# EAGLE design PIZ-II (EAGLE 7.6.0)
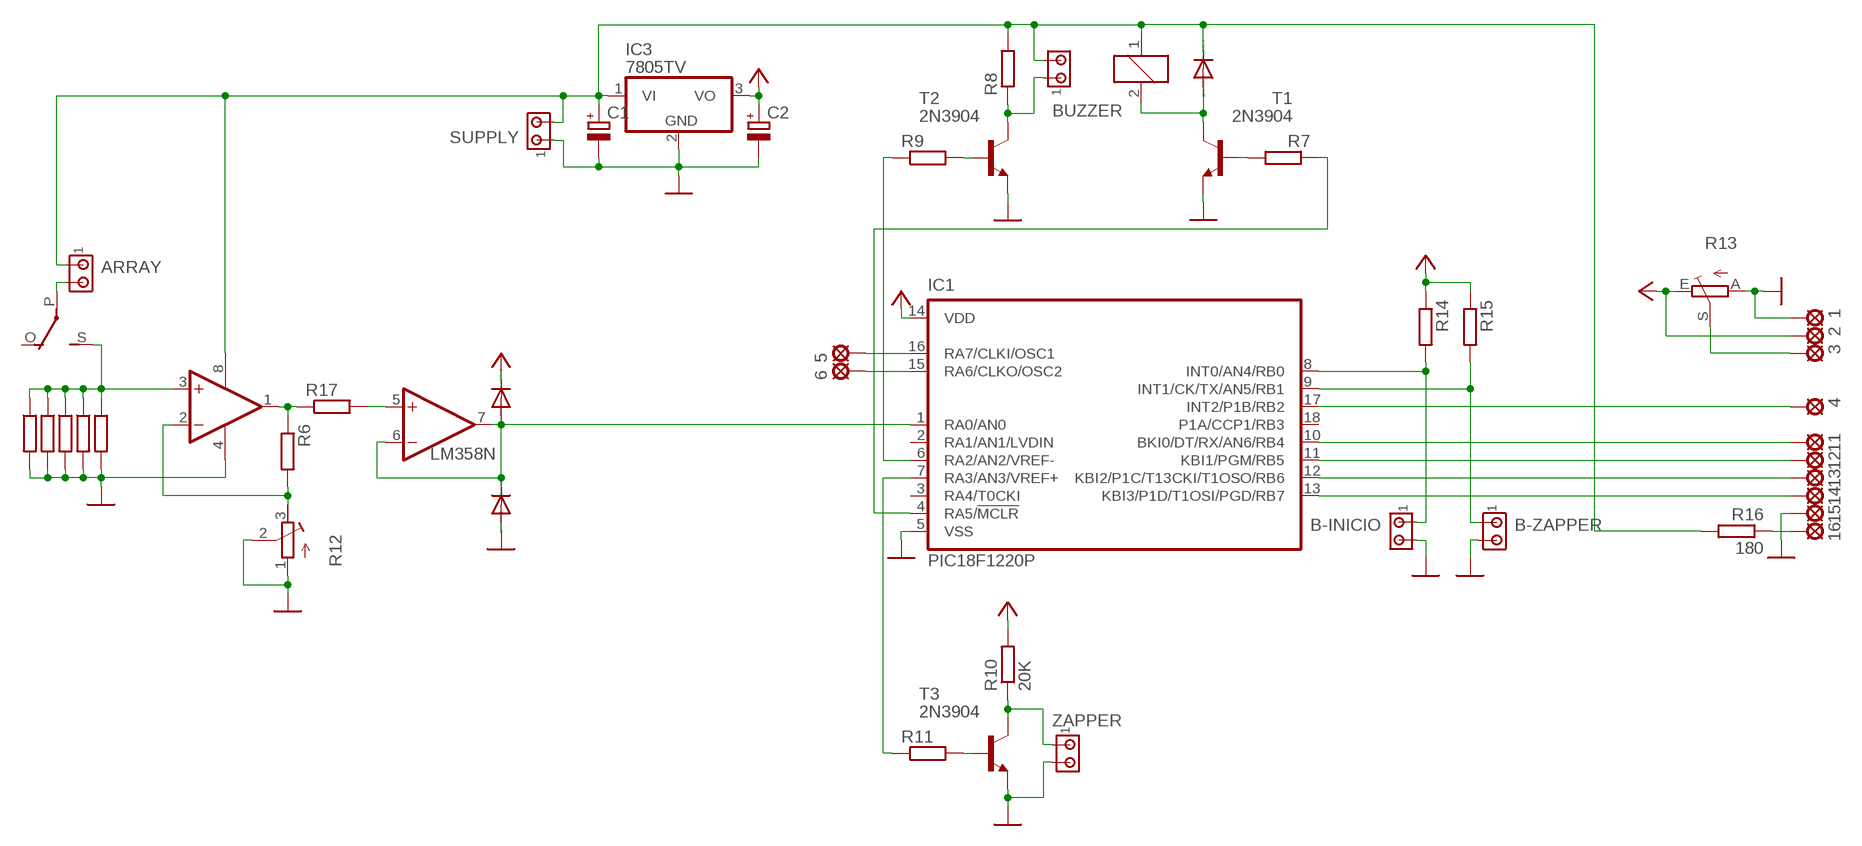
[diagram p0: schematic, sheet 1]

## Parts
1  LSP10  [LSP10]
2  LSP10  [LSP10]
3  LSP10  [LSP10]
4  LSP10  [LSP10]
5  LSP10  [LSP10]
6  LSP10  [LSP10]
11  LSP10  [LSP10]
12  LSP10  [LSP10]
13  LSP10  [LSP10]
14  LSP10  [LSP10]
15  LSP10  [LSP10]
16  LSP10  [LSP10]
ARRAY  MTA02-100  [10X02MTA]
B-INICIO  MTA02-100  [10X02MTA]
B-ZAPPER  MTA02-100  [10X02MTA]
BUZZER  MTA02-100  [10X02MTA]
C1  CPOL-EUE2.5-7  [E2,5-7]
C2  CPOL-EUE2.5-7  [E2,5-7]
D1  1N4148DO35-7  [DO35-7]
D2  1N4148DO35-7  [DO35-7]
D3  1N4148DO35-7  [DO35-7]
IC1  PIC18F1220P  [DIL18]
IC2  LM358N  [DIL08]
IC3  7805TV  [TO220V]
K1  G5L  [G5LE]
R1  R-EU_0204/7  [0204/7]
R2  R-EU_0204/7  [0204/7]
R3  R-EU_0204/7  [0204/7]
R4  R-EU_0204/7  [0204/7]
R5  R-EU_0204/7  [0204/7]
R6  R-EU_0204/7  [0204/7]
R7  R-EU_0204/7  [0204/7]
R8  R-EU_0204/7  [0204/7]
R9  R-EU_0204/7  [0204/7]
R10  20K  R-EU_0204/7  [0204/7]
R11  R-EU_0204/7  [0204/7]
R12  R-TRIMM64W  [RTRIM64W]
R13  TRIM_EU-CA6V  [CA6V]
R14  R-EU_0204/7  [0204/7]
R15  R-EU_0204/7  [0204/7]
R16  180  R-EU_0204/7  [0204/7]
R17  R-EU_0204/7  [0204/7]
SUPPLY  MTA02-100  [10X02MTA]
T1  2N3904  [TO92]
T2  2N3904  [TO92]
T3  2N3904  [TO92]
ZAPPER  MTA02-100  [10X02MTA]

## Nets
GND: 1.MP 15.MP B-INICIO.2 B-ZAPPER.2 C1.- C2.- D2.A IC1.5(VSS) IC2.4(P:V-) IC3.2(GND) R1.2 R2.2 R3.2 R4.2 R5.2 R12.1(A) R12.2(S) R13.A SUPPLY.1 T1.3(E) T2.3(E) T3.3(E) ZAPPER.2
N$1: IC2.3(A:+IN) K1.S(2:S) R1.1 R2.1 R3.1 R4.1 R5.1
N$2: ARRAY.2 K1.P(2:P)
N$3: IC2.5(B:+IN) R17.2
N$4: IC2.2(A:-IN) R6.2 R12.3(E)
N$5: BUZZER.1 R8.1 T2.1(C)
N$6: D1.A D2.C IC1.1(RA0/AN0) IC2.6(B:-IN) IC2.7(B:OUT)
N$7: D3.A K1.2 T1.1(C)
N$8: R10.1 T3.1(C) ZAPPER.1
N$9: R7.2 T1.2(B)
N$10: R9.2 T2.2(B)
N$11: R11.2 T3.2(B)
N$12: IC1.6(RA2/AN2/VREF-) R9.1
N$13: 4.MP IC1.17(INT2/P1B/RB2)
N$14: IC1.4(RA5/!MCLR) R7.1
N$15: 14.MP IC1.13(KBI3/P1D/T1OSI/PGD/RB7)
N$16: 13.MP IC1.12(KBI2/P1C/T13CKI/T1OSO/RB6)
N$17: 12.MP IC1.11(KBI1/PGM/RB5)
N$18: 11.MP IC1.10(BKI0/DT/RX/AN6/RB4)
N$19: IC2.1(A:OUT) R6.1 R17.1
N$20: 5.MP IC1.16(RA7/CLKI/OSC1)
N$21: 6.MP IC1.15(RA6/CLKO/OSC2)
N$22: 3.MP R13.S
N$23: B-INICIO.1 IC1.8(INT0/AN4/RB0) R14.2
N$24: B-ZAPPER.1 IC1.9(INT1/CK/TX/AN5/RB1) R15.2
N$25: 16.MP R16.1
N$26: ARRAY.1 BUZZER.2 C1.+ D3.C IC2.8(P:V+) IC3.1(VI) K1.1 R8.2 R16.2 SUPPLY.2
N$27: IC1.7(RA3/AN3/VREF+) R11.1
VCC: 2.MP C2.+ D1.C IC1.14(VDD) IC3.3(VO) R10.2 R13.E R14.1 R15.1
Unconnected: IC1.2(RA1/AN1/LVDIN) IC1.3(RA4/T0CKI) IC1.18(P1A/CCP1/RB3) K1.O(2:O)

## Library data of the parts
1-6 11-16 = solpad:LSP10: SOLDER PAD drill 1.0 mm, distributor Buerklin, 12H555
ARRAY B-INICIO B-ZAPPER BUZZER SUPPLY ZAPPER = con-amp:MTA02-100: AMP connector
C1 C2 = rcl:CPOL-EU: POLARIZED CAPACITOR, European symbol
D1-D3 = diode:1N4148: DIODE high speed (Philips)
IC1 = microchip:PIC18F1*20: 18/20/28-Pin High-Performance, Enhanced Flash Microcontrollers with 10-bit A/D and nanoWatt Technology Source: ww1.microchip.com/downloads/en/DeviceDoc/39605c.pdf; MF: MICROCHIP; MPN: PIC18F1220-I/P; OC_FARNELL: 9761977; OC_NEWARK: 92C2429
IC2 = linear:LM358: OP AMP also LM158; LM258; LM2904 Source: http://cache.national.com/ds/LM/LM158.pdf
IC3 = linear:78*: Positive VOLTAGE REGULATOR Source: http://cache.national.com/ds/LM/LM78L05.pdf http://www.fairchildsemi.com/ds/LM/LM7805.pdf
K1 = relay:G5L: RELAY 1 x switch, 10 A/120 V AC, 8 A/30 V ADC, Omron; OC_FARNELL: unknown; OC_NEWARK: unknown
R1-R11 R14-R17 = rcl:R-EU_: RESISTOR, European symbol
R12 = rcl:R-TRIMM: Trimm resistor
R13 = pot:TRIM_EU-: POTENTIOMETER
T1-T3 = transistor:2N3904: NPN TRANSISTOR

## Board
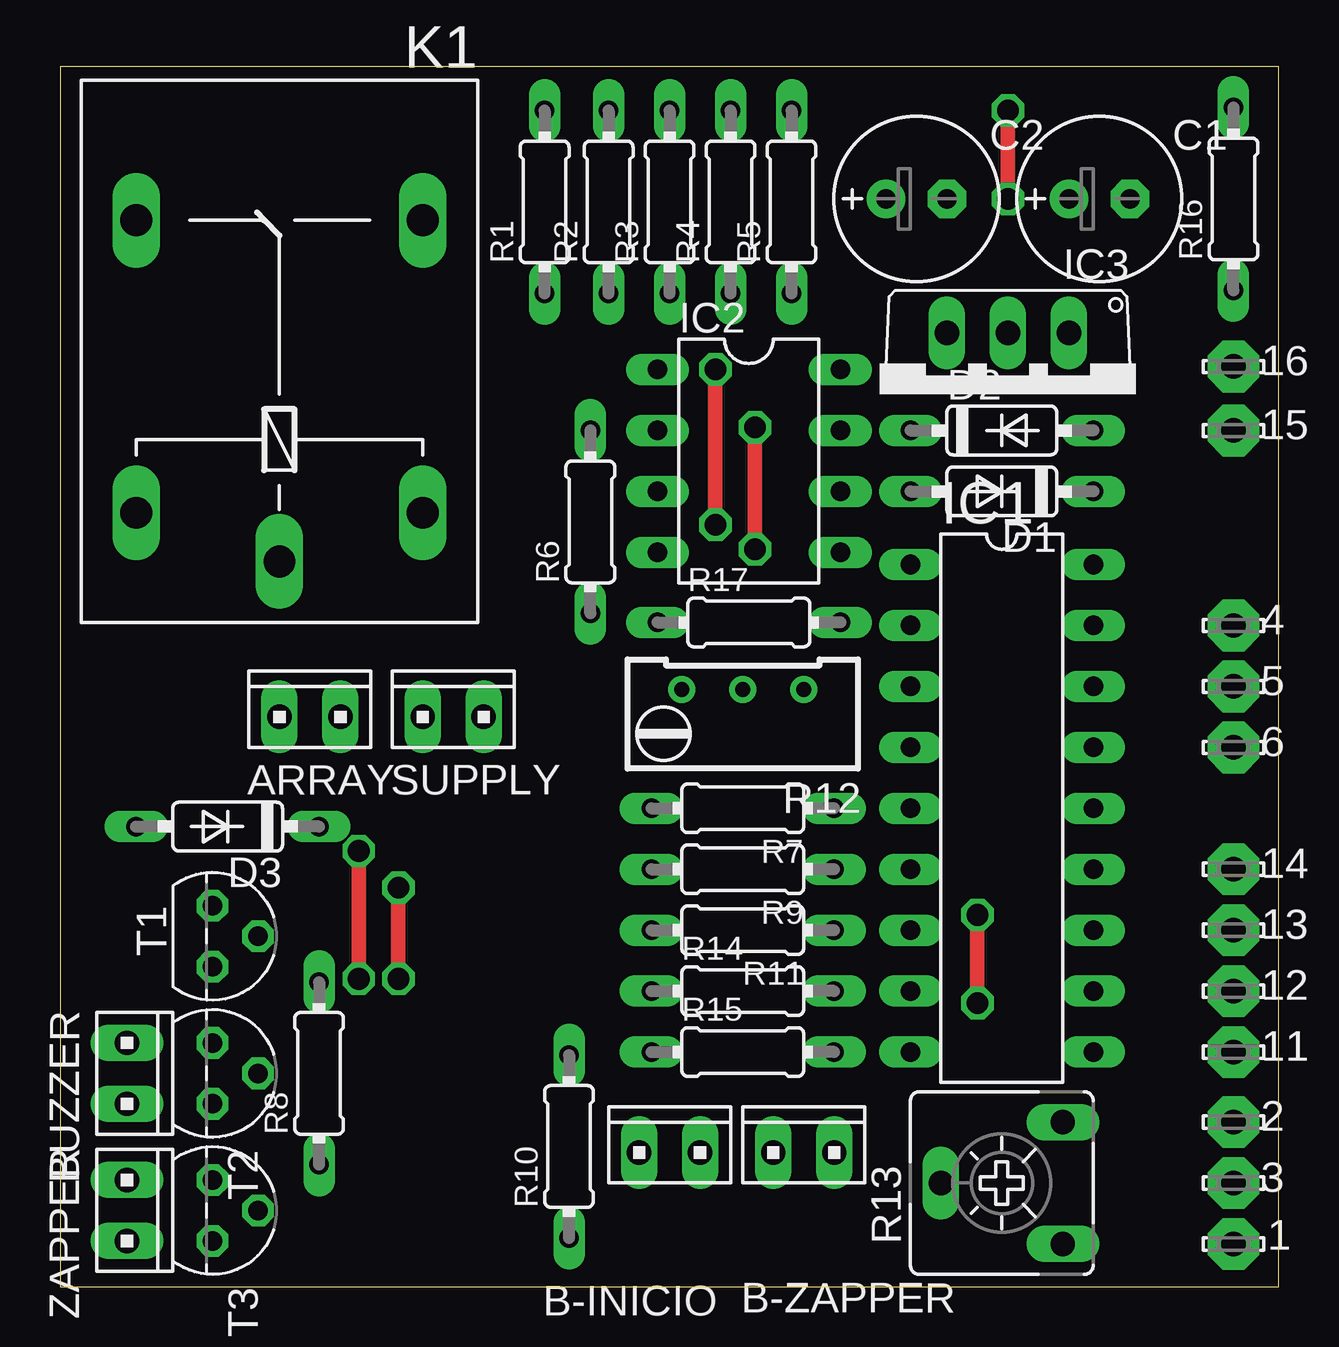
[diagram p1: board, top side]
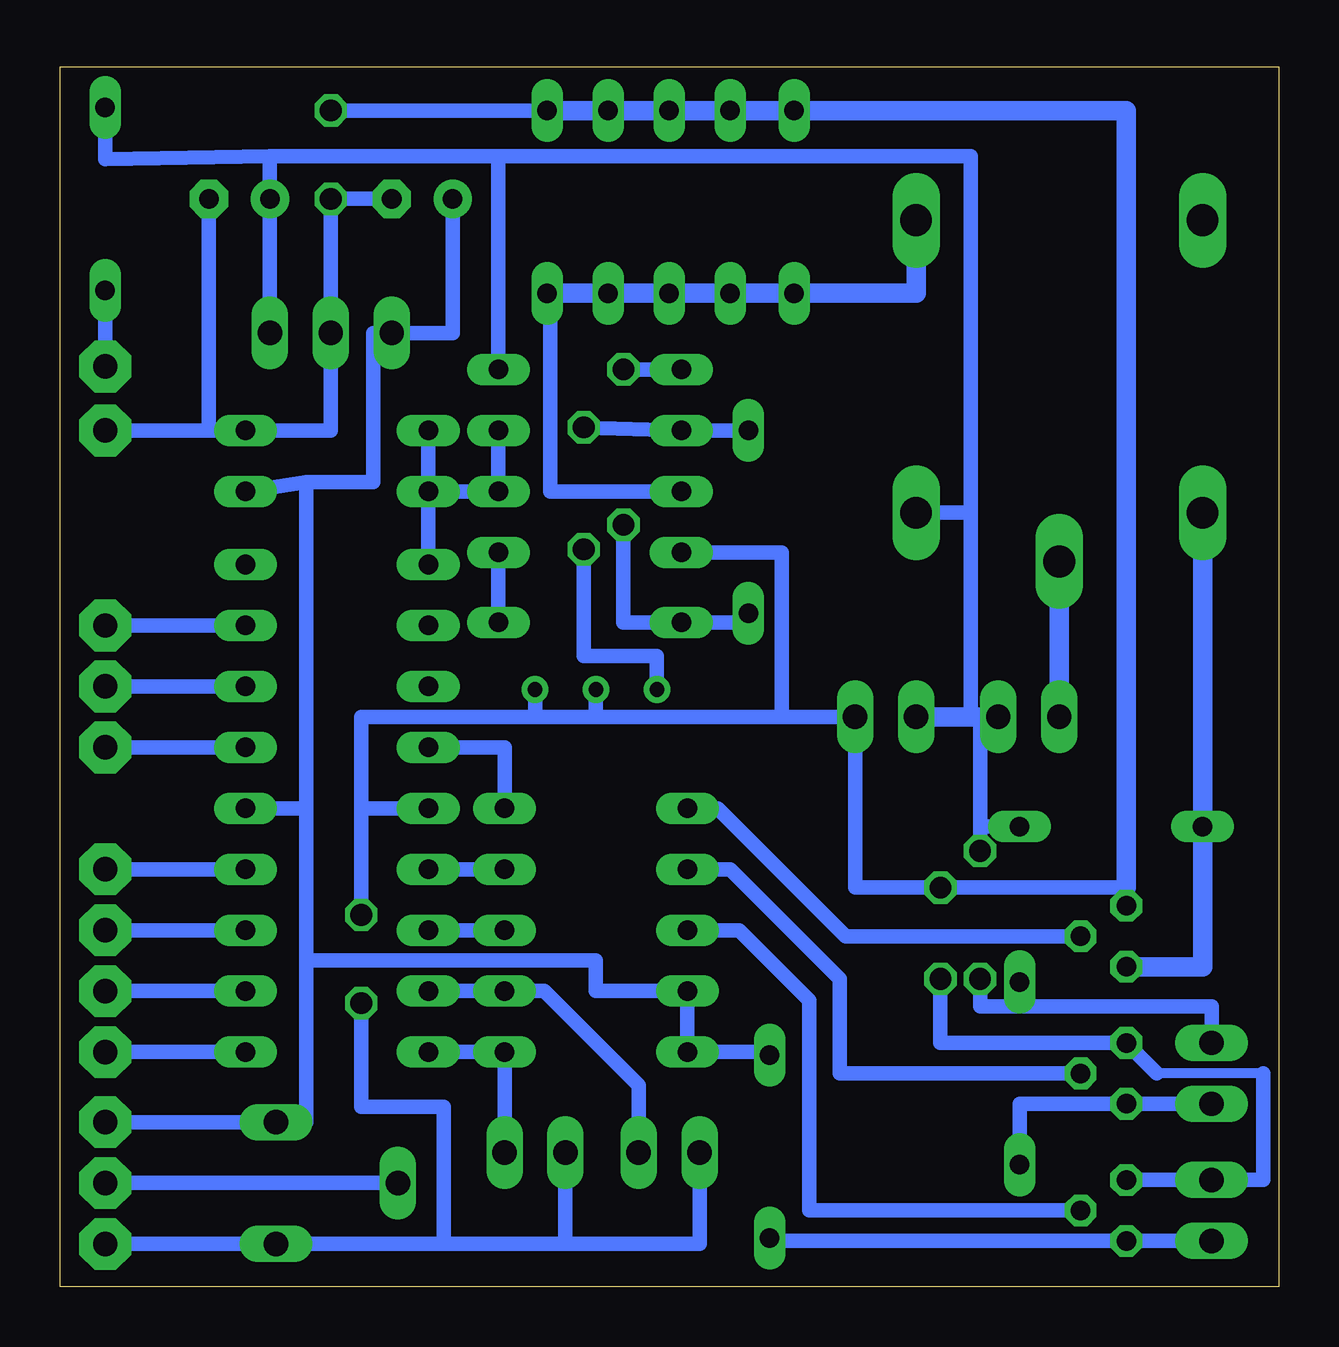
[diagram p2: board, bottom side, seen from below]

Size 50.78 x 50.85 mm. Coordinates in mm from the lower left corner, seen from the top.
Outline: 0,0 50.78,0 50.78,50.85 0,50.85 0,0
Copper layers (1*16): Top 0.035mm / dielectric 1.5mm / Bottom 0.035mm
Design rules "default": minimum track width 10mil, minimum drill 24mil, track to track 8mil, track to pad 8mil, pad to pad 8mil, via to via 8mil, smd to smd 8mil, copper to edge 40mil, drill to drill 8mil, minimum pad ring 10mil, minimum via ring 8mil, stop-mask expansion 4mil, vias tented up to drill 0mil, thermal gap 10mil

### Footprints (pad centres in the part's own frame; a part is rotated, then mirrored left to right if it is on the bottom)
LSP10 = drill 1.016 pad 2.159 octagon: MP 0,0
10X02MTA = drill 1.016 long: 1 1.27,0; 2 -1.27,0
E2,5-7 = drill 0.813 pad 1.6: + -1.27,0 | drill 0.813 pad 1.6 octagon: - 1.27,0
DO35-7 = drill 0.813 long: A 3.81,0; C -3.81,0
DIL18 = drill 0.813 long: 1 -10.16,-3.81; 2 -7.62,-3.81; 3 -5.08,-3.81; 4 -2.54,-3.81; 5 0,-3.81; 6 2.54,-3.81; 7 5.08,-3.81; 8 7.62,-3.81; 9 10.16,-3.81; 10 10.16,3.81; 11 7.62,3.81; 12 5.08,3.81; 13 2.54,3.81; 14 0,3.81; 15 -2.54,3.81; 16 -5.08,3.81; 17 -7.62,3.81; 18 -10.16,3.81
DIL08 = drill 0.813 pad 1.27 long: 1 -3.81,-3.81; 2 -1.27,-3.81; 3 1.27,-3.81; 4 3.81,-3.81; 5 3.81,3.81; 6 1.27,3.81; 7 -1.27,3.81; 8 -3.81,3.81
TO220V = drill 1.016 long: 1 -2.54,-2.54; 2 0,-2.54; 3 2.54,-2.54
G5LE = drill 1.321 long: 1 -7.493,-5.969; 2 -7.493,5.969; O 4.699,5.969; P -9.525,0; S 4.699,-5.969
0204/7 = drill 0.813 long: 1 -3.81,0; 2 3.81,0
RTRIM64W = drill 0.61: 1 1.27,-2.54; 2 1.27,0; 3 1.27,2.54
CA6V = drill 1.016 long: A -2.54,-2.54; E 2.54,-2.54; S 0,2.54
TO92 = drill 0.813 octagon: 1 1.27,0; 2 0,1.905; 3 -1.27,0

### Placement (x,y rotation side)
1  48.9,1.78 0 top
2  48.9,6.86 0 top
3  48.9,4.32 0 top
4  48.9,27.56 0 top
5  48.9,25.02 0 top
6  48.9,22.48 0 top
11  48.9,9.78 0 top
12  48.9,12.32 0 top
13  48.9,14.86 0 top
14  48.9,17.4 0 top
15  48.9,35.69 0 top
16  48.9,38.35 0 top
ARRAY  10.41,23.75 0 top
B-INICIO  25.4,5.59 0 top
B-ZAPPER  30.99,5.59 0 top
BUZZER  2.79,8.89 270 top
C1  43.31,45.34 0 top
C2  35.69,45.34 0 top
D1  39.24,33.15 180 top
D2  39.24,35.69 0 top
D3  6.99,19.18 180 top
IC1  39.24,19.94 270 top
IC2  28.7,34.42 270 top
IC3  39.5,37.21 180 top
K1  9.14,39.75 90 top
R1  20.19,45.21 90 top
R2  22.86,45.21 90 top
R3  25.4,45.21 90 top
R4  27.94,45.21 90 top
R5  30.48,45.21 90 top
R6  22.1,31.88 90 top
R7  28.45,19.94 180 top
R8  10.79,8.89 90 top
R9  28.45,17.4 180 top
R10  21.21,5.84 90 top
R11  28.45,14.86 180 top
R12  28.45,23.62 90 top
R13  39.24,4.32 90 top
R14  28.45,12.32 0 top
R15  28.45,9.78 0 top
R16  48.9,45.34 90 top
R17  28.7,27.69 0 top
SUPPLY  16.38,23.75 0 top
T1  6.35,14.61 270 top
T2  6.35,8.89 270 top
T3  6.35,3.17 270 top
ZAPPER  2.79,3.17 270 top

### Tracks (layer width: path | path; a pad name or v marks a point on that pad's centre or on a via)
GND  (via drill 0.9)
  Top 0.61: v38.23,15.49 v38.23,11.81 | v39.5,45.34 v39.5,49.02 | v14.1,12.83 v14.1,16.64
  Bottom 0.406: 0.64,8.89 5.08,8.89
  Bottom 0.61: C1.- 44.58,35.69 | 44.58,35.69 D2.A 39.5,35.69 IC3.2 v39.5,45.34 C2.- | 38.23,19.94 38.23,23.75 30.99,23.75 | 15.MP 44.58,35.69 | 1.MP R13.A 34.8,1.78 | 34.8,1.78 29.72,1.78 | B-ZAPPER.2 29.72,1.78 | 29.72,1.78 24.13,1.78 B-INICIO.2 | IC1.5 38.23,19.94 | 38.23,19.94 v38.23,15.49 | v38.23,11.81 38.23,7.49 34.8,7.49 34.8,1.78 | v39.5,49.02 R5.2 | R12.1 30.99,23.75 | 30.99,23.75 28.45,23.75 | R12.2 28.45,23.75 | 28.45,23.75 20.7,23.75 | 20.7,23.75 20.7,30.61 IC2.4 | T3.3 ZAPPER.2 0.64,4.45 0.64,8.89 | 5.08,8.89 T2.3 14.1,10.16 v14.1,12.83 | T1.3 6.35,16.64 v14.1,16.64 17.65,16.64 SUPPLY.1 20.7,23.75
  Bottom 0.813: R5.2 R4.2 R3.2 R2.2 R1.2 6.35,49.02 6.35,16.64
N$1
  Bottom 0.61: IC2.3 30.35,33.15 30.35,41.4
  Bottom 0.813: R5.1 30.35,41.4 R4.1 R3.1 R2.1 R1.1 15.11,41.4 K1.S
N$2
  Bottom 0.813: K1.P ARRAY.2
N$3
  Bottom 0.61: R17.2 IC2.5
N$4  (via drill 0.9)
  Top 0.61: v28.96,35.81 v28.96,30.73
  Bottom 0.61: R6.2 IC2.2 v28.96,35.81 | v28.96,30.73 28.96,26.29 25.91,26.29 R12.3
N$5
  Bottom 0.61: BUZZER.1 T2.1 10.79,7.62 R8.1
N$6
  Bottom 0.61: D1.A IC1.1 | IC2.7 IC2.6 D1.A | D1.A D2.C
N$7
  Bottom 0.813: K1.2 3.17,20.32 D3.A 3.17,13.34 T1.1
N$8
  Bottom 0.61: ZAPPER.1 T3.1 21.21,1.91 R10.1
N$9
  Bottom 0.61: R7.2 23.37,19.94 18.03,14.61 T1.2
N$10
  Bottom 0.61: T2.2 18.29,8.89 18.29,12.83 22.86,17.4 R9.2
N$11
  Bottom 0.61: 23.88,14.86 R11.2 22.48,14.86 19.56,11.94 19.56,3.17 T3.2
N$12
  Bottom 0.61: IC1.6 R9.1
N$13
  Bottom 0.61: IC1.17 4.MP
N$14
  Bottom 0.61: R7.1 32.26,22.48 IC1.4
N$15
  Bottom 0.61: IC1.13 14.MP
N$16
  Bottom 0.61: IC1.12 13.MP
N$17
  Bottom 0.61: IC1.11 12.MP
N$18
  Bottom 0.61: IC1.10 11.MP
N$19  (via drill 0.9)
  Top 0.61: v27.3,38.23 v27.3,31.75
  Bottom 0.61: v27.3,31.75 27.3,27.69 R17.1 22.1,27.69 R6.1 | IC2.1 v27.3,38.23
N$20
  Bottom 0.61: IC1.16 5.MP
N$21
  Bottom 0.61: IC1.15 6.MP
N$22
  Bottom 0.61: 3.MP R13.S
N$23
  Bottom 0.61: IC1.8 R14.2 30.61,12.32 26.67,8.38 B-INICIO.1
N$24
  Bottom 0.61: IC1.9 R15.2 B-ZAPPER.1
N$25
  Bottom 0.61: R16.1 16.MP
N$26  (via drill 0.9)
  Top 0.61: v12.45,12.83 v12.45,18.16
  Bottom 0.61: IC3.1 C1.+ 42.04,47.12 | IC2.8 32.51,47.12 | 32.51,47.12 42.04,47.12 | 42.04,47.12 48.9,46.99 R16.2 | BUZZER.2 2.79,11.68 10.79,11.68 | K1.1 12.83,32.26 | 12.83,32.26 12.83,47.12 32.51,47.12 | R8.2 10.79,11.68 | 10.79,11.68 12.45,11.68 v12.45,12.83 | v12.45,18.16 12.45,19.18 | 12.45,19.18 D3.C | 12.45,19.18 12.45,23.75 | 12.83,23.75 12.83,32.26
  Bottom 0.813: SUPPLY.2 12.83,23.75 12.45,23.75 ARRAY.1
N$27
  Bottom 0.61: R11.1 IC1.7
VCC
  Bottom 0.61: C2.+ 34.42,39.75 IC3.3 37.72,39.75 37.72,33.53 40.51,33.53 | 40.51,33.53 D1.C | IC1.14 40.51,19.94 | 40.51,19.94 40.51,33.53 | 40.51,13.59 28.45,13.59 28.45,12.32 R14.1 R15.1 21.21,9.78 R10.2 | 40.51,13.59 40.51,19.94 | 2.MP R13.E 40.51,6.86 40.51,13.59